# EasyEDA Pro project NeuralAccelerator_EasyEDA.epro, schematic LowPass
Create Date: 2024-09-16; Page Name: P1; Project Name: Neural; Schematic Name: LowPass; Update Date: 2024-09-16; Company: EasyEDA.com; Drawn: EasyEDA; Page Size: A4; Part Number: JLCPCB-002; Reviewed: EasyEDA; Version: V0.1
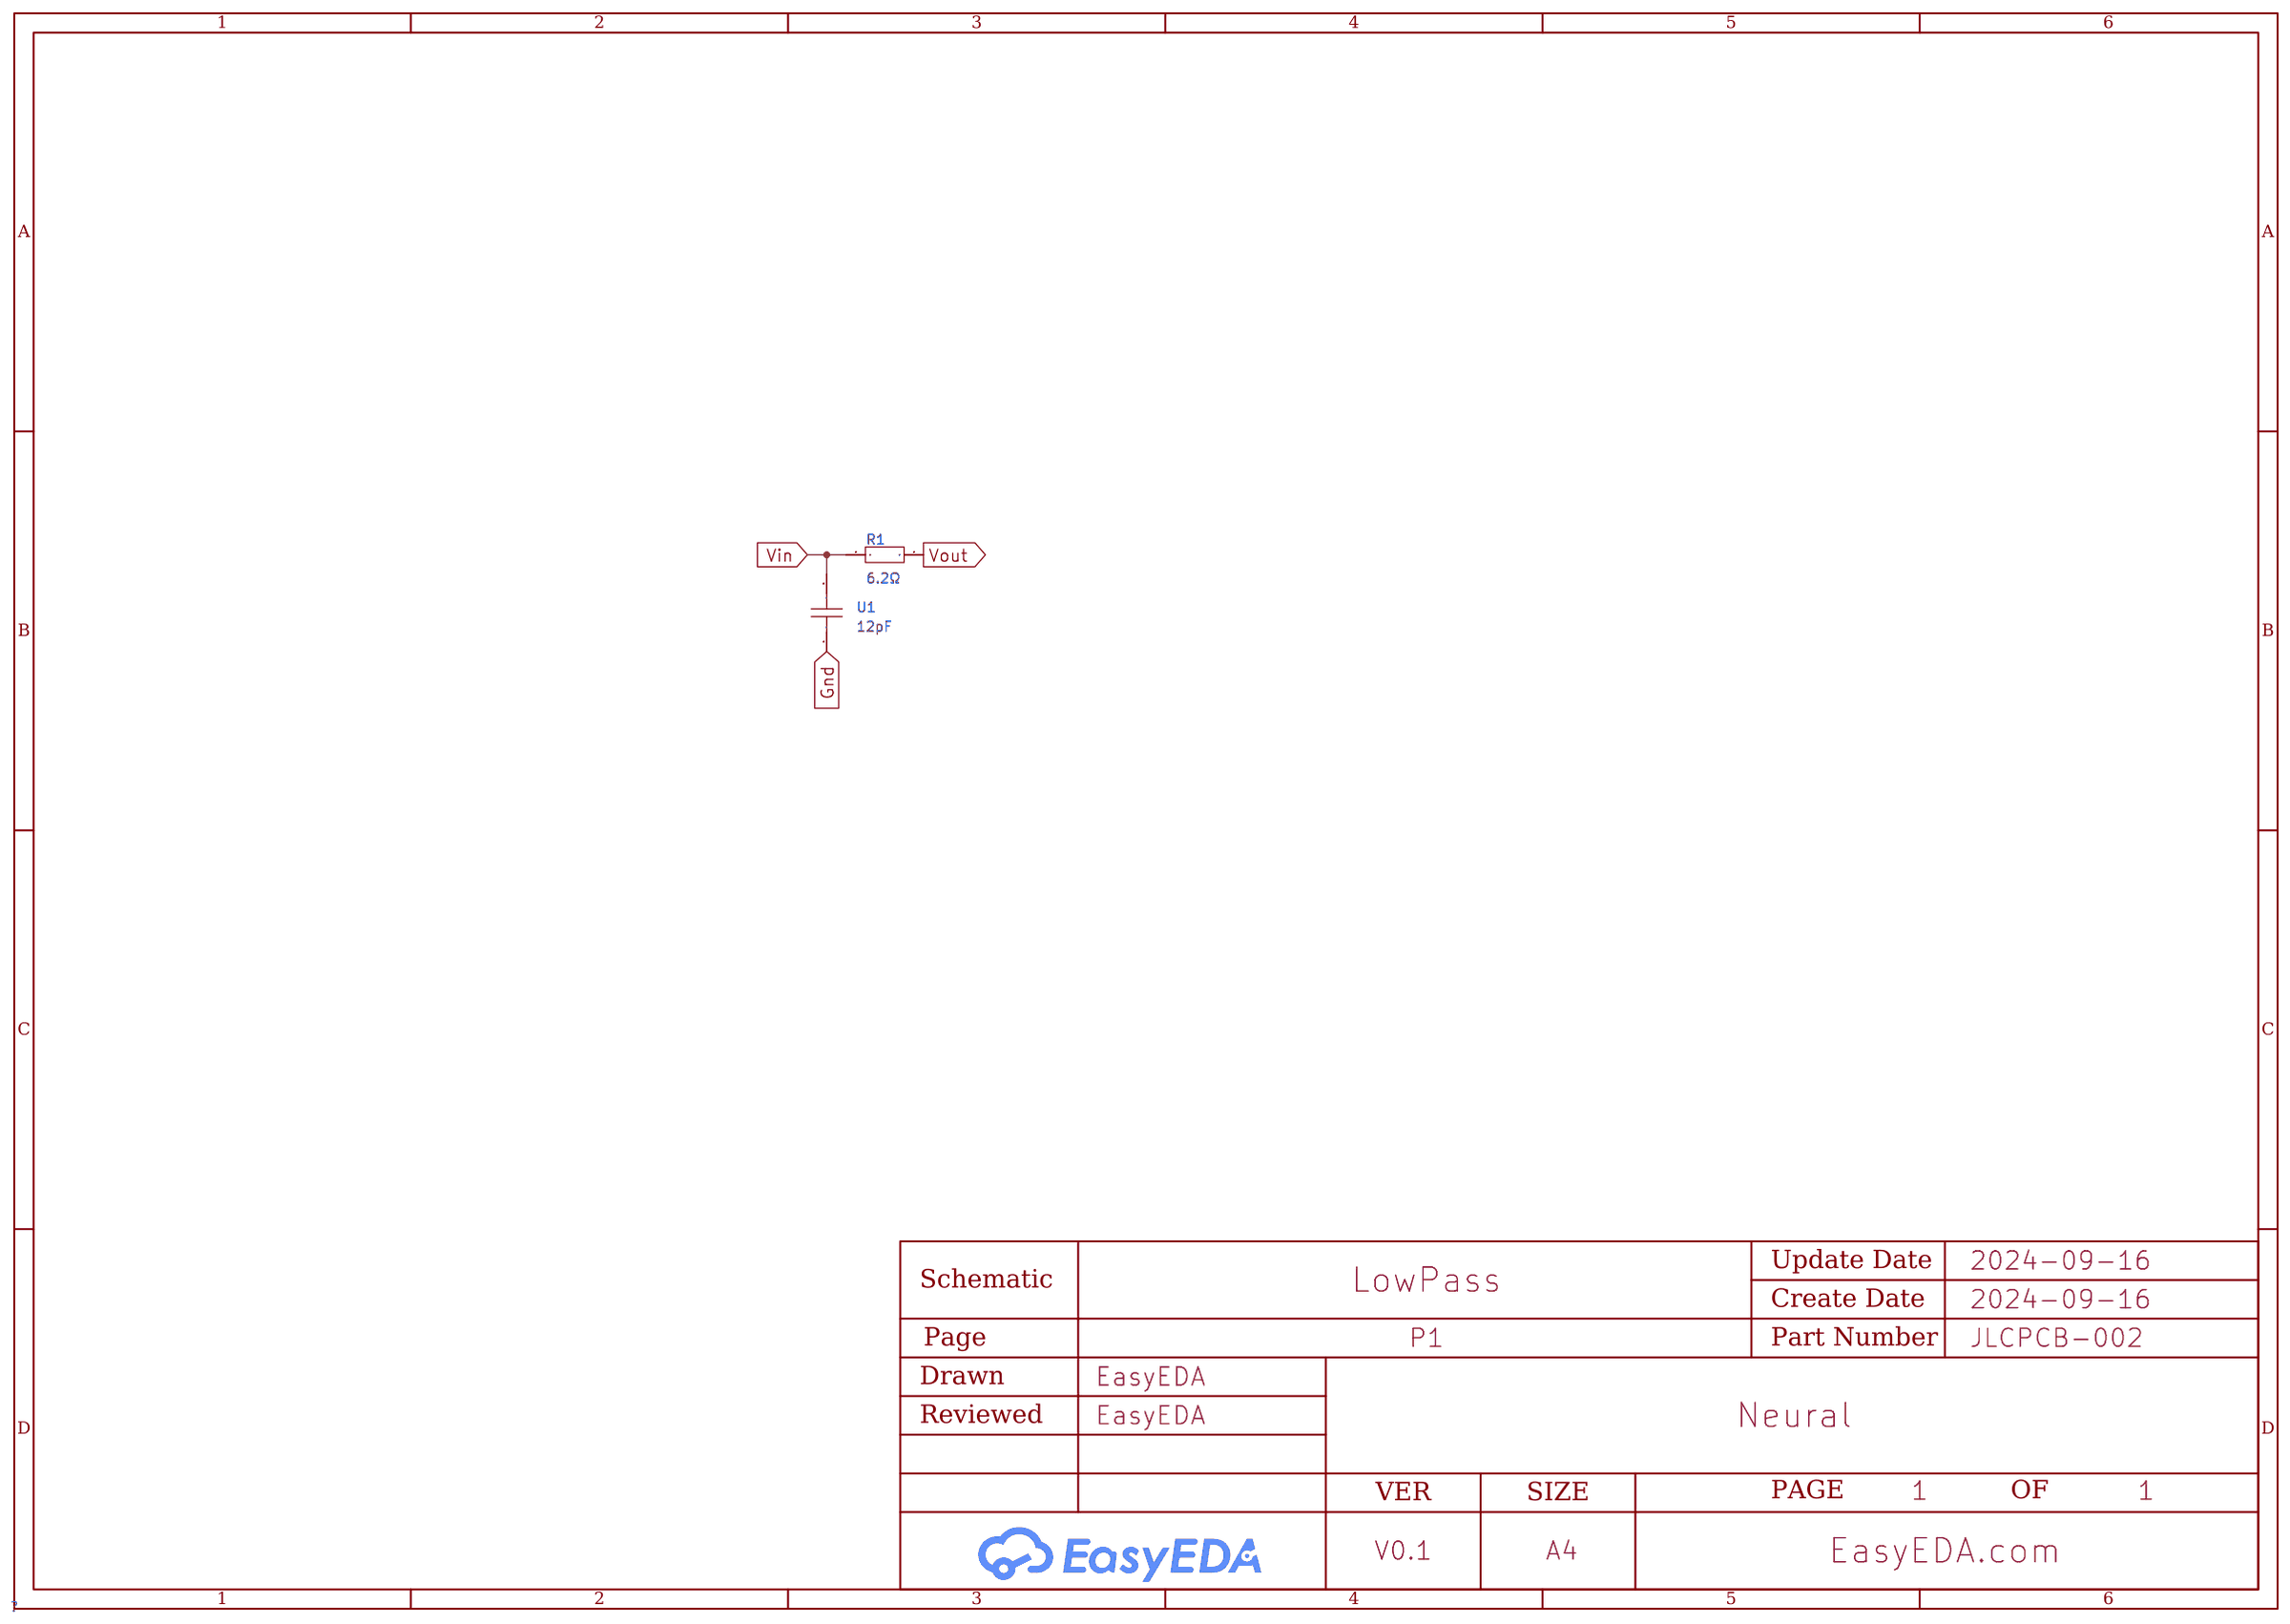
[diagram p2: schematic sheet]

## Parts
R1  6.2Ω  [R1206]
U1  12pF  [C1206]

## Library data of the parts
R1 = CR1206J406R2G: Type:Thick Film Resistors Resistance: Tolerance:±5% Tolerance:±5% Power(Watts): Overload Voltage (Max): Temperature Coefficient:-250ppm/℃~+500ppm/℃ Temperature Coefficient:-250ppm/℃~+500ppm/℃ Operating Temperature Range:-55℃~+125℃ Operating Temperature Ra; LCSC Part Name: 厚膜电阻 6.2Ω ±5% 250mW; Supplier Part: C102383; Manufacturer: LIZ(丽智电子); Supplier Footprint: 1206; Datasheet: https://atta.szlcsc.com/upload/public/pdf/source/20180403/C189438_6D658388CC7843F35BBC9018D03F0B8E.pdf; Supplier: LCSC; Type: Thick Film Resistors; Tolerance: ±5%; Temperature Coefficient: -250ppm/℃~+500ppm/℃; Operating Temperature Range: -55℃~+125℃
U1 = HC1206CG120G201: Capacitance: Tolerance:±2% Tolerance:±2% Voltage Rated: Temperature Coefficient:; LCSC Part Name: 12pF ±2% 200V; Supplier Part: C3836495; Manufacturer: Meritek; Supplier Footprint: 1206; Datasheet: https://atta.szlcsc.com/upload/public/pdf/source/20240117/558F4B049E06A6854C9EF4B8DE400D8F.pdf; Supplier: LCSC; Tolerance: ±2%

## Nets
Gnd: U1.1
Vin: R1.1 U1.2
Vout: R1.2
